# Altium schematic sheet ST-LINK.SchDoc
size 594 x 420 mm; Address1: Address1; Address2: Address2; Address3: Address3; Address4: Address4; SheetNumber: 1; Scale: 1:1; Разраб.: Иванов; Обозначение документа: АБВГ.123456.001 Э3; Пров.: Петров; Утв.: Сидоров; Наименование организации: ОАО "Концерн "МПО-Гидроприбор"; Перв. применение: АБВГ.123456.000; Наименование изделия 1: Плата; Наименование изделия 2: Схема электрическая; Наименование изделия 3: принципиальная; Нач. отд.: Нач. отд.; Фамилия нач. отд.: Сидоров
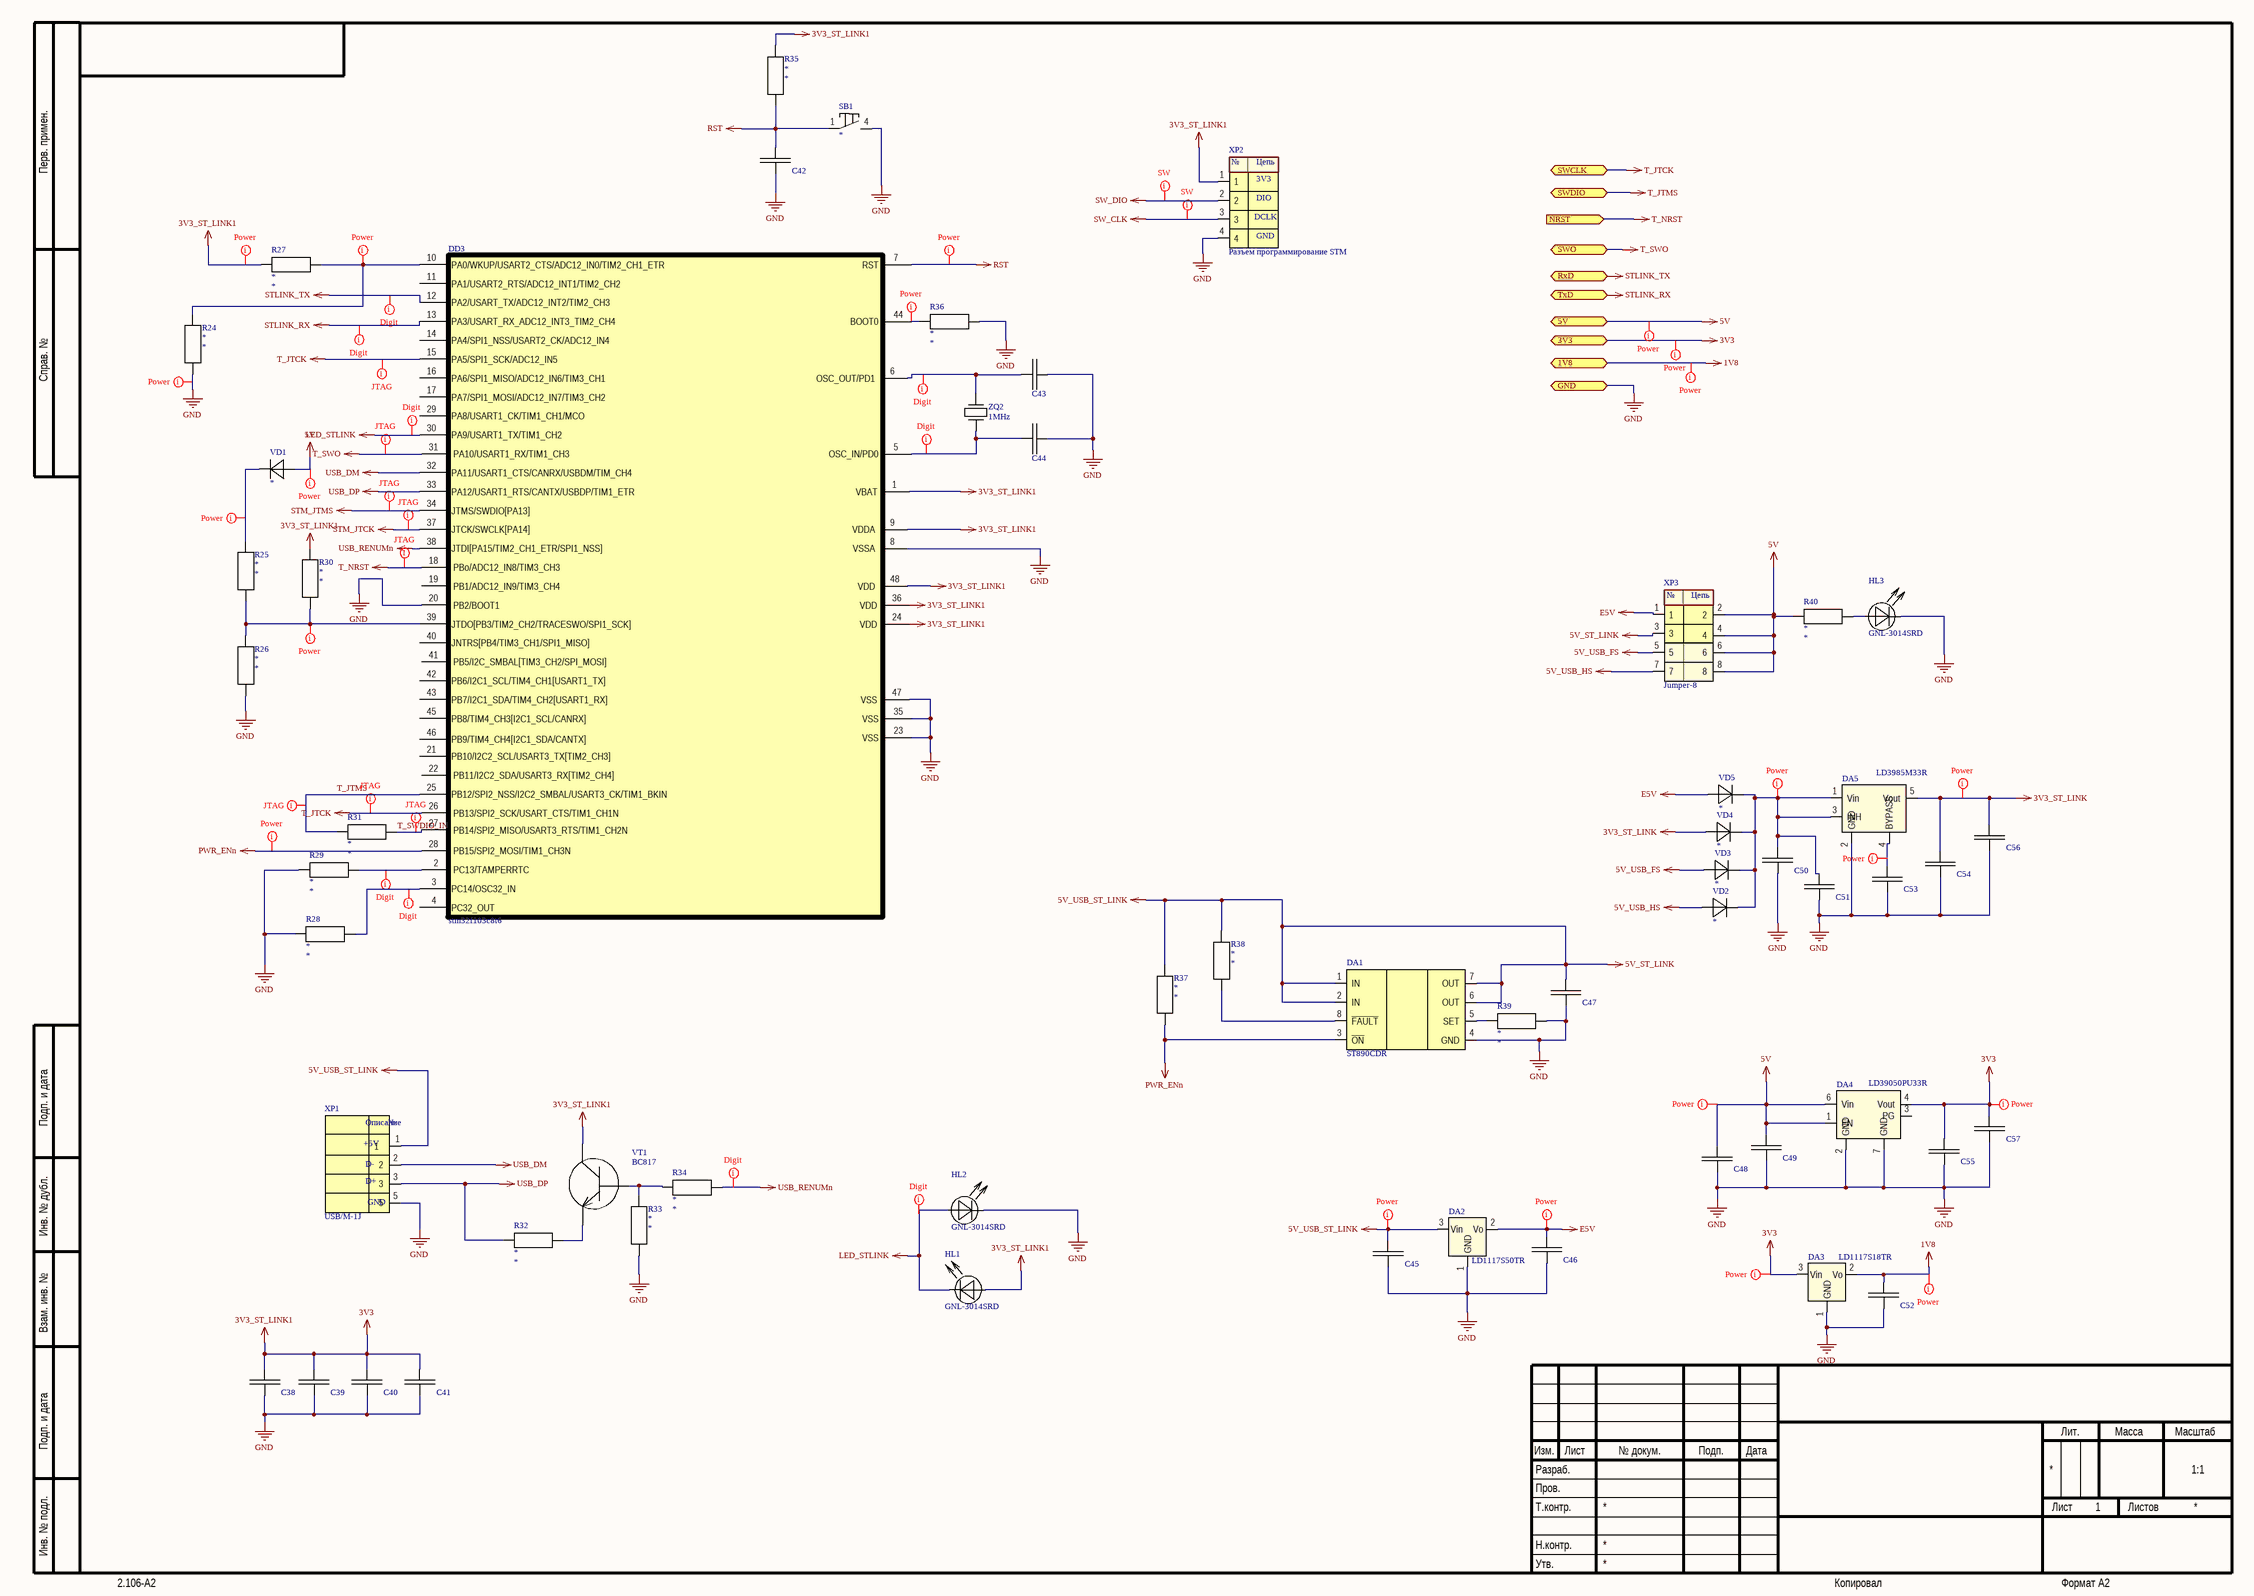
[diagram p0: ST-LINK.SchDoc]

## Parts
C38  *  [CAP0402]  (value not drawn)
C39  *  [CAP0402]  (value not drawn)
C40  *  [CAP0402]  (value not drawn)
C41  *  [CAP0402]  (value not drawn)
C42  *  [CAP0402]  (value not drawn)
C43  *  [CAP0402]  (value not drawn)
C44  *  [CAP0402]  (value not drawn)
C45  *  [CAP0402]  (value not drawn)
C46  *  [CAP0402]  (value not drawn)
C47  *  [CAP0402]  (value not drawn)
C48  *  [CAP0402]  (value not drawn)
C49  *  [CAP0402]  (value not drawn)
C50  *  [CAP0402]  (value not drawn)
C51  *  [CAP0402]  (value not drawn)
C52  *  [CAP0402]  (value not drawn)
C53  *  [CAP0402]  (value not drawn)
C54  *  [CAP0402]  (value not drawn)
C55  *  [CAP0402]  (value not drawn)
C56  *  [CAP0402]  (value not drawn)
C57  *  [CAP0402]  (value not drawn)
DA1  ST890CDR  [SO-8]
DA2  LD1117S50TR  [SOD-223]
DA3  LD1117S18TR  [SOD-223]
DA4  LD39050PU33R  [DFN-6(3x3)]
DA5  LD3985M33R  [SOT23-5]
DD3  stm32f103c8t6  [LQFP48]
HL1  GNL-3014SRD  [LED1206]
HL2  GNL-3014SRD  [LED1206]
HL3  GNL-3014SRD  [LED1206]
R24  *  [0402]
R25  *  [0402]
R26  *  [0402]
R27  *  [0402]
R28  *  [0402]
R29  *  [0402]
R30  *  [0402]
R31  *  [0402]
R32  *  [0402]
R33  *  [0402]
R34  *  [0402]
R35  *  [0402]
R36  *  [0402]
R37  *  [0402]
R38  *  [0402]
R39  *  [0402]
R40  *  [0402]
SB1  *  [KLS2]
VD1  *  [melf]
VD2  *  [MINIMELF]
VD3  *  [MINIMELF]
VD4  *  [MINIMELF]
VD5  *  [MINIMELF]
VT1  BC817  [SOT23-3]
XP1  USB/M-1J  [USB/M-1J]
XP2  Разъем программирование STM  [Connector_STKLink]
XP3  Jumper-8  [PLS-4-2]
ZQ2  1MHz  [HC-51U]

## Ports
1V8 (bidir), 3V3 (bidir), 5V (bidir), GND (bidir), NRST (in), RxD (bidir), SWCLK (bidir), SWDIO (bidir), SWO (bidir), TxD (bidir)

## Nets
1V8: C52.1 DA3.2(Vo) ; port 1V8
3V3: C38.1 C39.1 C40.1 C41.1 C55.1 C57.1 DA3.3(Vin) DA4.4(Vout) DD3.1(VBAT) DD3.9(VDDA) DD3.24(VDD) DD3.36(VDD) DD3.48(VDD) HL1.1 R27.1 R30.2 R35.2 VT1.3 XP2.1 ; port 3V3  [also labelled 3V3_ST_LINK1]
3V3_ST_LINK: C54.1 C56.1 DA5.5(Vout) VD4.1
5V: C48.1 C49.1 DA4.1(EN) DA4.6(Vin) R40.2 VD1.1 XP3.2 XP3.4 XP3.6 XP3.8 ; port 5V
5V_ST_LINK: C45.1 C47.1 DA1.1(IN) DA1.2(IN) DA1.6(OUT) DA1.7(OUT) DA2.3(Vin) R37.2 R38.2 XP1.1 XP3.3  [also labelled 5V_USB_ST_LINK]
5V_USB_FS: VD3.1 XP3.5
5V_USB_HS: VD2.1 XP3.7
E5V: C46.1 DA2.2(Vo) VD5.1 XP3.1
GND: C38.2 C39.2 C40.2 C41.2 C42.2 C43.2 C44.2 C45.2 C46.2 C47.2 C48.2 C49.2 C50.2 C51.2 C52.2 C53.2 C54.2 C55.2 C56.2 C57.2 DA1.4(GND) DA2.1(GND) DA3.1(GND) DA4.2(GND) DA4.7(GND) DA5.2(GND) DD3.8(VSSA) DD3.20(PB2/BOOT1) DD3.23(VSS) DD3.35(VSS) DD3.47(VSS) HL2.2 HL3.2 R24.1 R26.1 R28.1 R29.1 R33.1 R36.1 R39.1 SB1.4 XP1.5 XP2.4 ; port GND
LED_STLINK: DD3.30(PA9/USART1_TX/TIM1_CH2) HL1.2 HL2.1
PWR_ENn: DA1.3(~{ON}) DD3.28(PB15/SPI2_MOSI/TIM1_CH3N) R37.1
RST: C42.1 DD3.7(RST) R35.1 SB1.1
STLINK_RX: DD3.13(PA3/USART_RX_ADC12_INT3_TIM2_CH4) ; port TxD
STLINK_TX: DD3.12(PA2/USART_TX/ADC12_INT2/TIM2_CH3) ; port RxD
STM_JTCK: DD3.37(JTCK/SWCLK[PA14])
STM_JTMS: DD3.34(JTMS/SWDIO[PA13])
SW_CLK: XP2.3
SW_DIO: XP2.2
T_JTCK: DD3.15(PA5/SPI1_SCK/ADC12_IN5) DD3.26(PB13/SPI2_SCK/USART_CTS/TIM1_CH1N) ; port SWCLK
T_JTMS: DD3.25(PB12/SPI2_NSS/I2C2_SMBAL/USART3_CK/TIM1_BKIN) R31.1 ; port SWDIO
T_NRST: DD3.18(PBo/ADC12_IN8/TIM3_CH3) ; port NRST
T_SWO: DD3.31(PA10/USART1_RX/TIM1_CH3) ; port SWO
USB_DM: DD3.32(PA11/USART1_CTS/CANRX/USBDM/TIM_CH4) XP1.2
USB_DP: DD3.33(PA12/USART1_RTS/CANTX/USBDP/TIM1_ETR) R32.1 XP1.3
USB_RENUMn: DD3.38(JTDI[PA15/TIM2_CH1_ETR/SPI1_NSS]) R34.2
T_SWDIO_IN: DD3.27(PB14/SPI2_MISO/USART3_RTS/TIM1_CH2N) R31.2
NetC43_1: C43.1 DD3.6(OSC_OUT/PD1) ZQ2.3
NetC44_1: C44.1 DD3.5(OSC_IN/PD0) ZQ2.1
NetC50_1: C50.1 C51.1 DA5.1(Vin) DA5.3(INH) VD2.2 VD3.2 VD4.2 VD5.2
NetC53_1: C53.1 DA5.4(BYPASS)
NetDA1_5: DA1.5(SET) R39.2
NetDA1_8: DA1.8(~{FAULT}) R38.1
NetDD3_2: DD3.2(PC13/TAMPERRTC) R29.2
NetDD3_3: DD3.3(PC14/OSC32_IN) R28.2
NetDD3_10: DD3.10(PA0/WKUP/USART2_CTS/ADC12_IN0/TIM2_CH1_ETR) R24.2 R27.2
NetDD3_39: DD3.39(JTDO[PB3/TIM2_CH2/TRACESWO/SPI1_SCK]) R25.1 R26.2 R30.1
NetDD3_44: DD3.44(BOOT0) R36.2
NetHL3_1: HL3.1 R40.1
NetR25_2: R25.2 VD1.2
NetR32_2: R32.2 VT1.2
NetR33_2: R33.2 R34.1 VT1.1

Not connected (* = marked no-connect by the designer): DA4 3(PG); DD3 4(PC32_OUT) 11(PA1/USART2_RTS/ADC12_INT1/TIM2_CH2) 14(PA4/SPI1_NSS/USART2_CK/ADC12_IN4) 16(PA6/SPI1_MISO/ADC12_IN6/TIM3_CH1) 17(PA7/SPI1_MOSI/ADC12_IN7/TIM3_CH2) 19(PB1/ADC12_IN9/TIM3_CH4) 21(PB10/I2C2_SCL/USART3_TX[TIM2_CH3]) 22(PB11/I2C2_SDA/USART3_RX[TIM2_CH4]) 29(PA8/USART1_CK/TIM1_CH1/MCO) 40(JNTRS[PB4/TIM3_CH1/SPI1_MISO]) 41(PB5/I2C_SMBAL[TIM3_CH2/SPI_MOSI]) 42(PB6/I2C1_SCL/TIM4_CH1[USART1_TX]) 43(PB7/I2C1_SDA/TIM4_CH2[USART1_RX]) 45(PB8/TIM4_CH3[I2C1_SCL/CANRX]) 46(PB9/TIM4_CH4[I2C1_SDA/CANTX])

## Layout directives
net class Power: 1V8, 3V3, 3V3_ST_LINK, 5V, 5V_ST_LINK, E5V, GND, NetC50_1, NetC53_1, NetDD3_10, NetDD3_39, NetDD3_44, NetR25_2, PWR_ENn, RST
net class DIGIT: LED_STLINK, NetC43_1, NetC44_1, NetDD3_2, NetDD3_3, STLINK_RX, STLINK_TX, USB_RENUMn
net class JTAG: STM_JTCK, STM_JTMS, T_JTCK, T_JTMS, T_NRST, T_SWDIO_IN, T_SWO
net class SerialWire: SW_CLK, SW_DIO

## Notes on the sheet
- Перв. примен.
- Справ. №
- Подп. и дата
- Инв. № дубл.
- Взам. инв. №
- Разраб.
- Изм.
- Лист
- № докум.
- Подп.
- Дата
- Лит.
- Масса
- Масштаб
- Пров.
- Т.контр.
- Листов
- Инв. № подл.
- Утв.
- Н.контр.
- 2.106-A2
- Копировал
- Формат А2
- (in symbol Connector_STKLink) №; Цепь; 3V3; DIO; DCLK; GND
- (in symbol Jumper-8) №; Цепь
- (in symbol USB-M-1J) Описание; №; +5V; D-; D+; GND

## Library data of the parts
C38-C57 = Capasitor: Value: *; Voltage: *; Part Number: *; Quantity: *; Package: *; Price: *; Manufacturer: *; ShoppingPlace: *
DA1 = ST890CDR: Manufacturer: Texas Instruments; Value: 3V; Part Number: ST890CDR; Quantity: 1; Package: SOT-23-6; Price: 1.58; ShoppingPlace: https://www.digikey.com/product-detail/en/texas-instruments/TPS78230DDCR/296-24372-2-ND/2051745
DA2 = LD1117S50TR: Manufacturer: Texas Instruments; Value: 3V; Part Number: LD1117S50TR; Quantity: 1; Package: SOT-23-6; Price: 1.58
DA3 = LD1117S18TR: Manufacturer: Texas Instruments; Value: 3V; Part Number: LD1117S18TR; Quantity: 1; Package: SOT-23-6; Price: 1.58
DA4 = LD39050PU33R: Manufacturer: Texas Instruments; Value: 3V; Part Number: LD39050PU33R; Quantity: 1; Package: SOT-23-6; Price: 1.58
DA5 = LD3985M33R: Manufacturer: Texas Instruments; Value: 3V; Part Number: LD3985M33R; Quantity: 1; Package: SOT-23-6; Price: 1.58; ShoppingPlace: https://www.digikey.com/product-detail/en/texas-instruments/TPS78230DDCR/296-24372-2-ND/2051745
DD3 = stm32f103c8t6: Manufacturer: STM; Part Number: stm32f103c8t6; Package: LQFP48; Quantity: 1
HL1-HL3 = LED: Manufacturer: G-NOR; Value: RED; Part Number: GNL-3014SRD; Price: 0.04; Package: GNL; Quantity: 6; Shopping Place: http://belchip.by/product/?selected_product=00813
R24-R40 = Resistor: Manufacturer: *; Quntity: *; Price: *; Part Number: *; Package: *; Value: *; Power: *
SB1 = Button: Part Number: *; Price: *; Value: *; ShoppingPlace: *; Quantity: *; Package: *; Manufacturer: *
VD1-VD5 = Basic_Diode: Part Number: *; Package: *; Value: *; Price: *; ShoppingPlace: *; Documantation: *
VT1 = BC817: Manufacturer: NXP Semiconductors; Value: 45V,500mA; Part Number: BC817; Price: BC817; Quantity: 2; Documantion: https://www.diodes.com/assets/Datasheets/ds11107.pdf
XP1 = USB-M-1J: Manufacturer: ESB; ShoppingPlace: http://belchip.by/product/?selected_product=07369; Price: 2; Value: *; Package: ESB 22 SERIES; Part Number: USB/M-1J; Quantity: 1
XP2 = Connector_STKLink: Part Number: *; Value: *; Manufacturer: *; Price: *; Quantity: *; shoppingPlace: *
ZQ2 = Rzanator: Part Number: HC-51; Manufacturer: CHina; Value: 1MHz; Package: HC-51; Quantity: 1; Price: 13; ShoppingPlace: https://ru.aliexpress.com/item/1-MHz-Quartz-Crystal-Resonator-HC-51-U-1-000-MHz-1000-KHz/32542776281.html?ws_ab_test=searchweb0_0,searchweb201602_2_10152_10151_10065_10344_10068_10342_10343_10340_10341_10697_10696_10084_5722520_10083_10618_10307_10059_5722620_5722920_10534_308_5722720_5722820_100031_10103_441_10624_10623_10622_10621_10620,searchweb201603_68,ppcSwitch_5&algo_expid=89d4295e-121a-47e9-b7f5-26405723b7a9-0&algo_pvid=89d4295e-121a-47e9-b7f5-26405723b7a9&transAbTest=ae803_2&priceBeautifyAB=0
XP3 = Jumper-8: Package: *; Part Number: *; Value: *; Quantity: *; Price: *